# EAGLE design PC-FX (EAGLE 9.6.2)
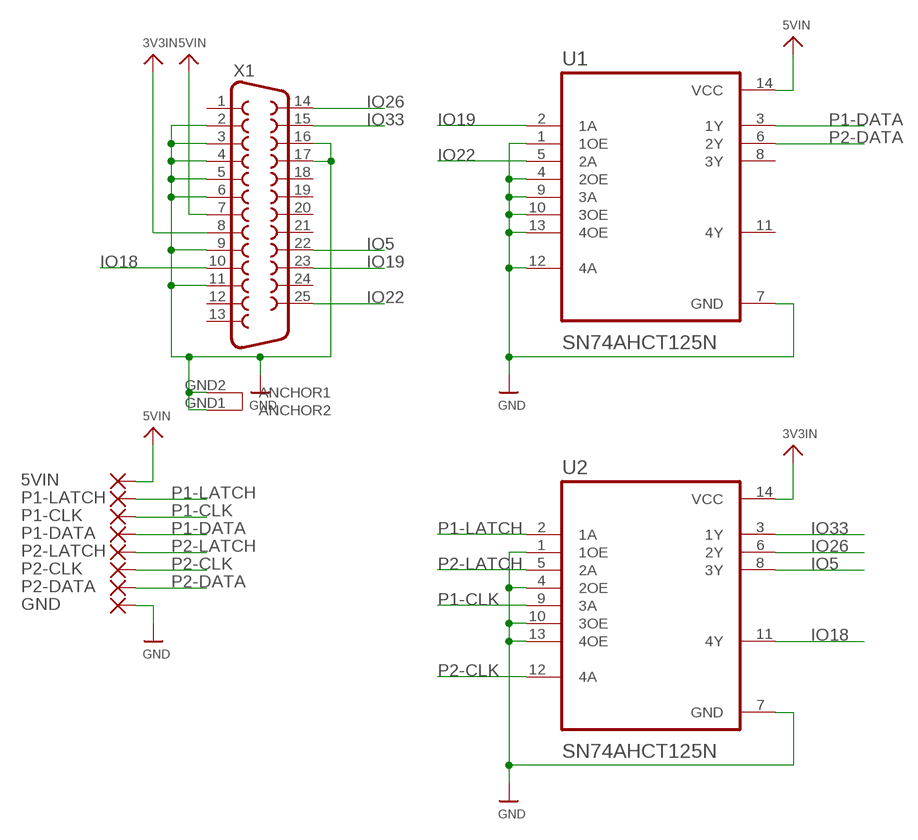
[diagram p0: schematic, sheet 1]

## Parts
5VIN  SMD5  [SMD2,54-5,08]
GND  SMD5  [SMD2,54-5,08]
P1-CLK  SMD5  [SMD2,54-5,08]
P1-DATA  SMD5  [SMD2,54-5,08]
P1-LATCH  SMD5  [SMD2,54-5,08]
P2-CLK  SMD5  [SMD2,54-5,08]
P2-DATA  SMD5  [SMD2,54-5,08]
P2-LATCH  SMD5  [SMD2,54-5,08]
U1  SN74AHCT125N  [DIP794W45P254L1969H508Q14]
U2  SN74AHCT125N  [DIP794W45P254L1969H508Q14]
X1  DB25_FEMALEHP  [F25HP]

## Nets
3V3IN: U2.14(VCC) X1.8
5VIN: 5VIN.1(P) U1.14(VCC) X1.7
GND: GND.1(P) U1.1(1OE) U1.4(2OE) U1.7(GND) U1.9(3A) U1.10(3OE) U1.12(4A) U1.13(4OE) U2.1(1OE) U2.4(2OE) U2.7(GND) U2.10(3OE) U2.13(4OE) X1.2 X1.3 X1.4 X1.5 X1.6 X1.9 X1.11 X1.16 X1.17 X1.GND1(ANCHOR2) X1.GND2(ANCHOR1)
IO5: U2.8(3Y) X1.22
IO18: U2.11(4Y) X1.10
IO19: U1.2(1A) X1.23
IO22: U1.5(2A) X1.25
IO26: U2.6(2Y) X1.14
IO33: U2.3(1Y) X1.15
P1-CLK: P1-CLK.1(P) U2.9(3A)
P1-DATA: P1-DATA.1(P) U1.3(1Y)
P1-LATCH: P1-LATCH.1(P) U2.2(1A)
P2-CLK: P2-CLK.1(P) U2.12(4A)
P2-DATA: P2-DATA.1(P) U1.6(2Y)
P2-LATCH: P2-LATCH.1(P) U2.5(2A)
Unconnected: U1.8(3Y) U1.11(4Y) X1.1 X1.12 X1.13 X1.18 X1.19 X1.20 X1.21 X1.24

## Library data of the parts
5VIN GND P1-CLK P1-DATA P1-LATCH P2-CLK P2-DATA P2-LATCH = wirepad:SMD5: SMD PAD
U1 U2 = SN74AHCT125N:SN74AHCT125N: None Check prices <https://pricing.snapeda.com/parts/SN74AHCT125N/Texas%20Instruments/view-part?ref=eda>; AVAILABILITY: In Stock; DESCRIPTION: Quadruple Bus Buffer Gates With 3-State Outputs 14-PDIP -40 to 125; MF: Texas Instruments; MP: SN74AHCT125N; PACKAGE: PDIP-14 Texas Instruments; PRICE: None; PURCHASE-URL: https://pricing.snapeda.com/search/part/SN74AHCT125N/?ref=eda
X1 = SparkFun-Retired:DB25_FEMALE: 25 Pin male connector. PCB edge mount for regular PCB thicknesses. This connector will connect directly to the back of a PC parallel port or through a normal DB25 extension cable (M/F). SKU: PRT-08287

## Board
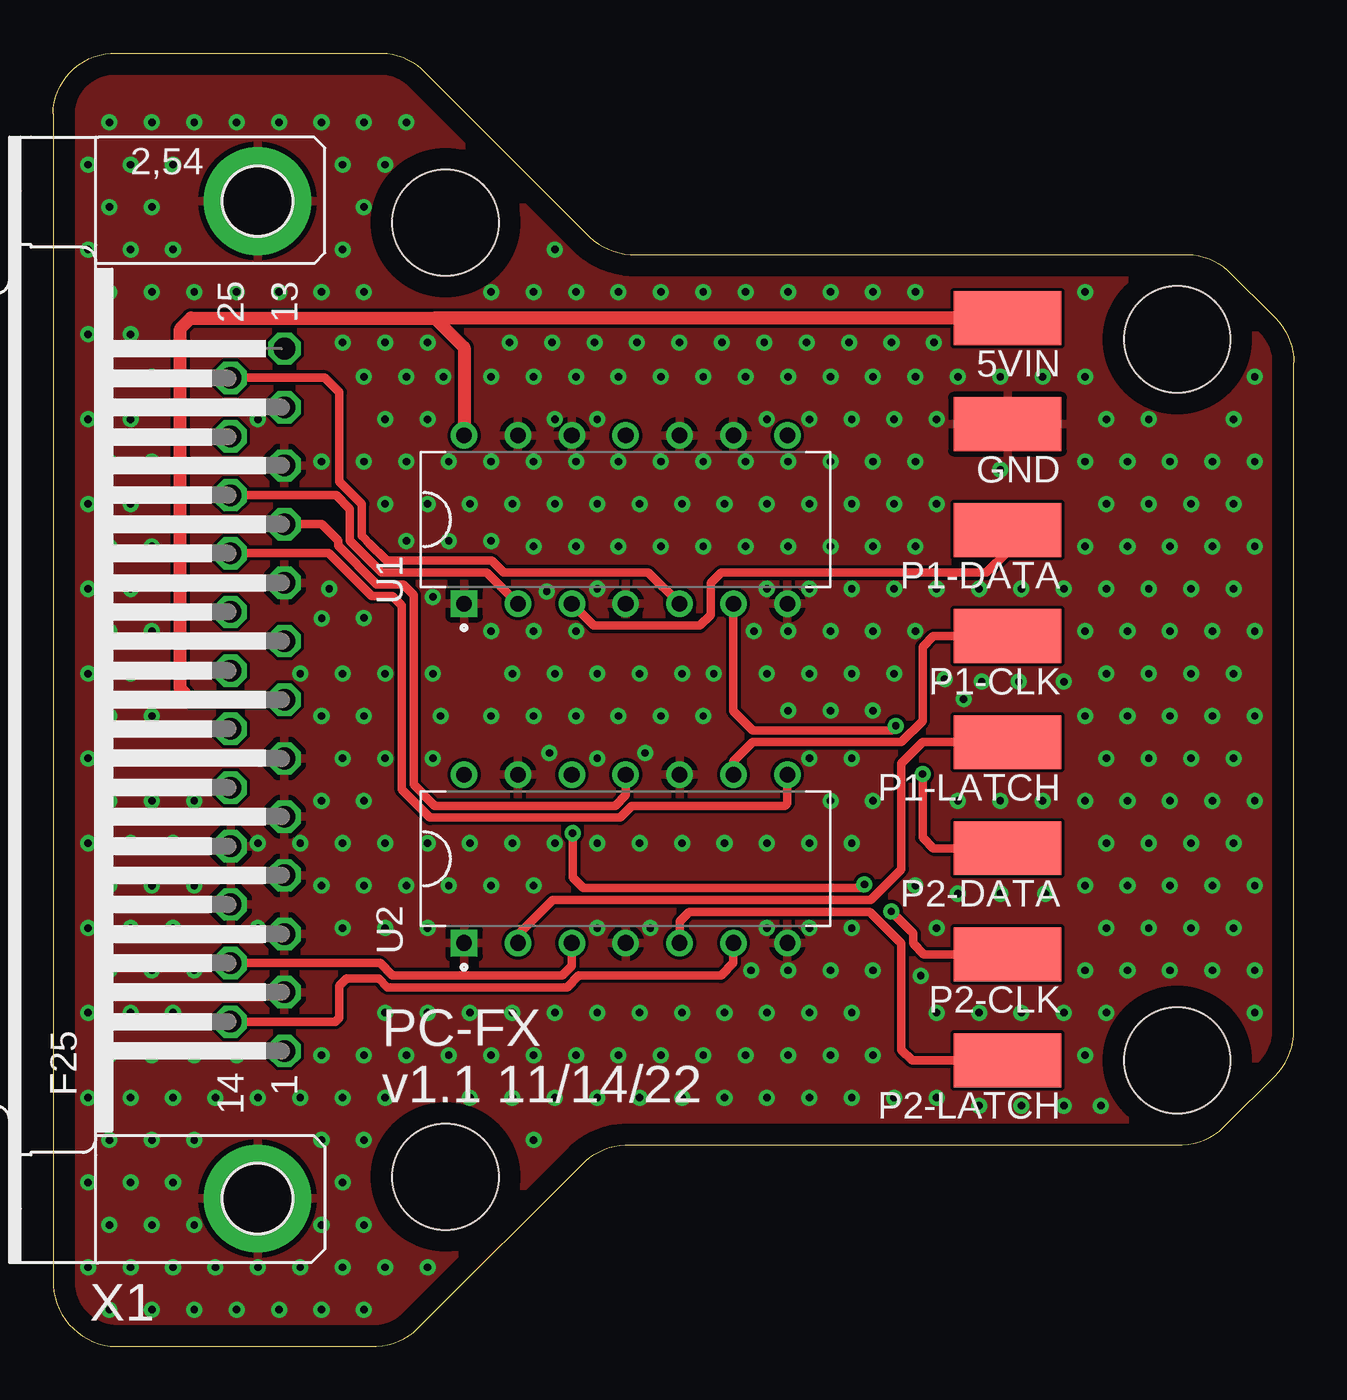
[diagram p1: board, top side]
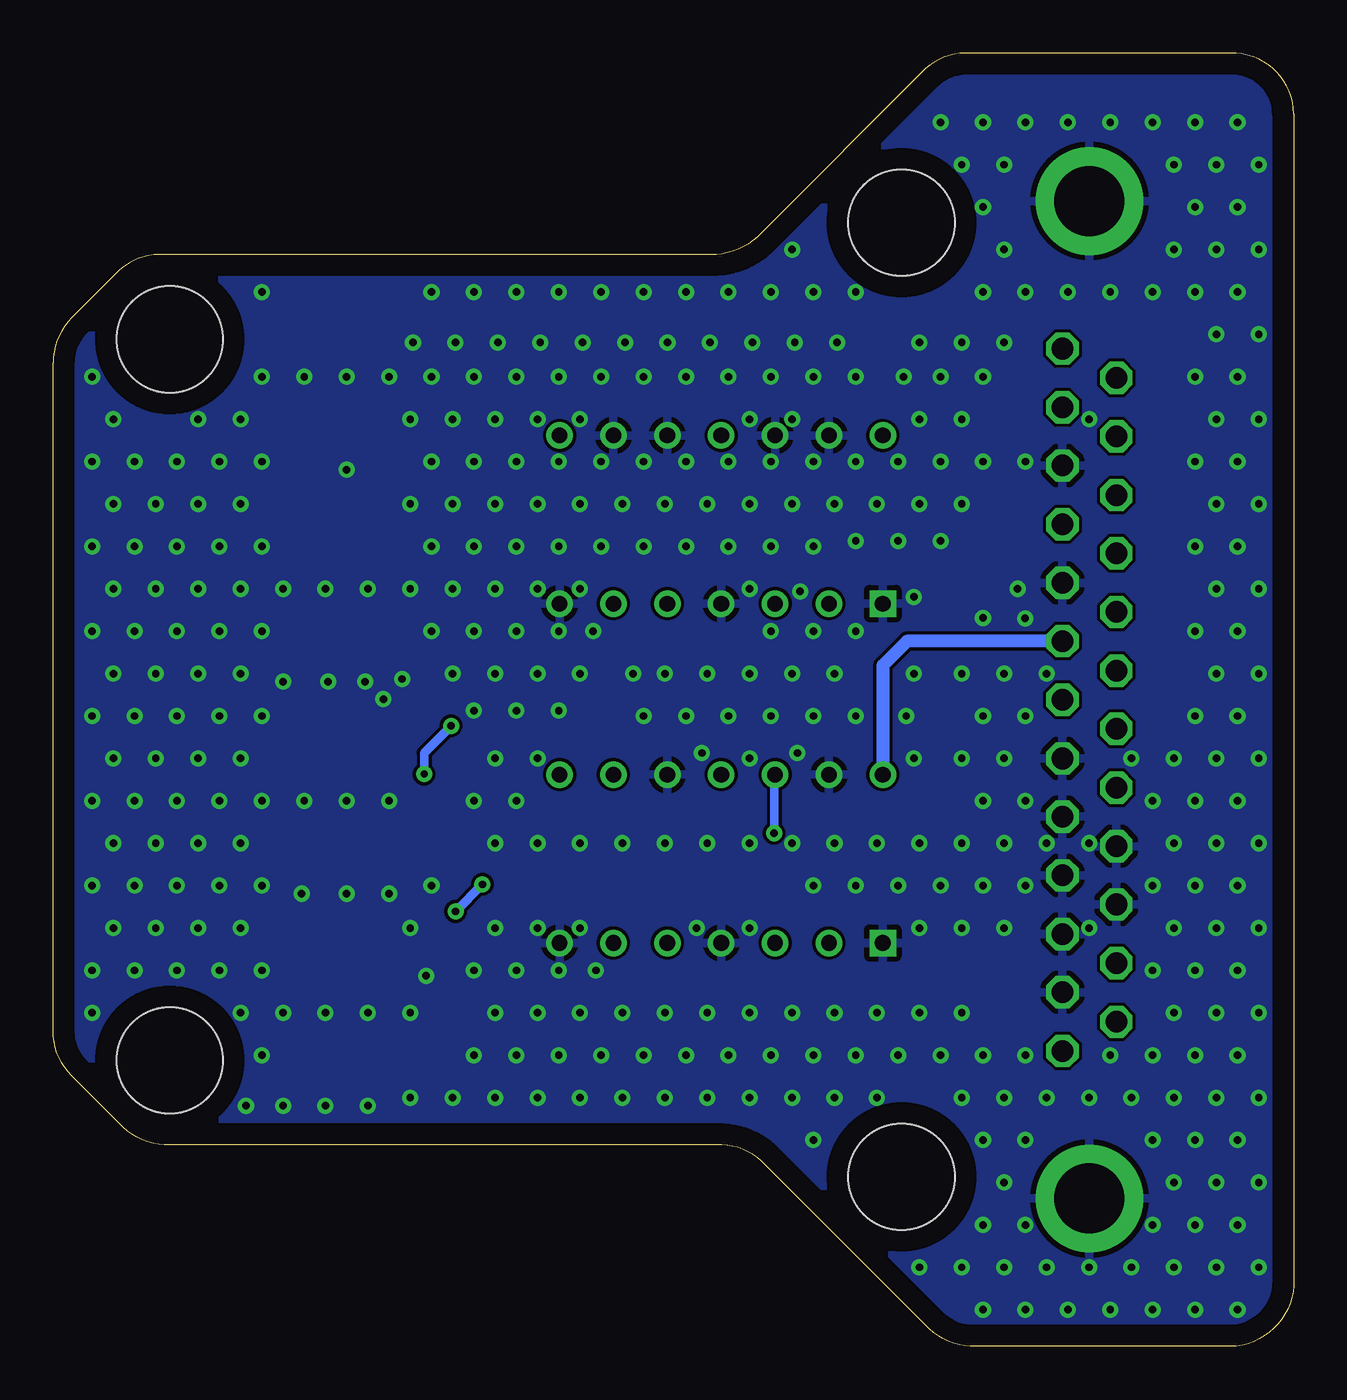
[diagram p2: board, bottom side, seen from below]

Size 58.5 x 61 mm. Coordinates in mm from the lower left corner, seen from the top.
Outline: 0,58.14 0,3.14 arc90 2.99,0 15.25,0 arc45 17.37,1.02 25.11,8.76 arc-45 27.23,9.5 53.25,9.5 arc45 55.37,10.52 57.61,12.76 arc45 58.5,14.88 58.5,46.4 arc45 57.61,48.52 55.37,50.76 arc45 53.25,51.5 27.23,51.5 arc-45 25.11,52.52 17.37,60.26 arc45 15.25,61 2.99,61 arc90 0,58.14
Copper layers (1*16): Top 0.035mm / dielectric 1.5mm / Bottom 0.035mm
Design rules "default": minimum track width 6mil, minimum drill 0.35mm, track to track 6mil, track to pad 6mil, pad to pad 6mil, via to via 6mil, smd to smd 6mil, copper to edge 40mil, drill to drill 6mil, minimum pad ring 10mil, minimum via ring 8mil, stop-mask expansion 4mil, vias tented up to drill 0.5mm, thermal gap 10mil
Holes 5 mm at 53,13.5 53,47.5 18.5,53 18.5,8

### Footprints (pad centres in the part's own frame; a part is rotated, then mirrored left to right if it is on the bottom)
SMD2,54-5,08 = smd 2.54 x 5.08: 1 0,0
DIP794W45P254L1969H508Q14 = drill 0.74 pad 1.14 square: 1 -3.97,7.62 | drill 0.74 pad 1.14: 2 -3.97,5.08; 3 -3.97,2.54; 4 -3.97,0; 5 -3.97,-2.54; 6 -3.97,-5.08; 7 -3.97,-7.62; 8 3.97,-7.62; 9 3.97,-5.08; 10 3.97,-2.54; 11 3.97,0; 12 3.97,2.54; 13 3.97,5.08; 14 3.97,7.62
F25HP = drill 1.016 octagon: 1 -16.561,-1.27; 2 -13.792,-1.27; 3 -11.049,-1.27; 4 -8.28,-1.27; 5 -5.512,-1.27; 6 -2.769,-1.27; 7 0,-1.27; 8 2.769,-1.27; 9 5.512,-1.27; 10 8.28,-1.27; 11 11.049,-1.27; 12 13.792,-1.27; 13 16.561,-1.27; 14 -15.189,1.27; 15 -12.421,1.27; 16 -9.652,1.27; 17 -6.909,1.27; 18 -4.14,1.27; 19 -1.372,1.27; 20 1.372,1.27; 21 4.14,1.27; 22 6.909,1.27; 23 9.652,1.27; 24 12.421,1.27; 25 15.189,1.27 | drill 3.302 pad 5.08: GND1 -23.52,0; GND2 23.52,0

### Placement (x,y rotation side)
5VIN  45,48.5 90 top
GND  45,43.5 90 top
P1-CLK  45,33.5 90 top
P1-DATA  45,38.5 90 top
P1-LATCH  45,28.5 90 top
P2-CLK  45,18.5 90 top
P2-DATA  45,23.5 90 top
P2-LATCH  45,13.5 90 top
U1  27,39 90 top
U2  27,23 90 top
X1  9.64,30.5 90 top

### Tracks (layer width: path | path; a pad name or v marks a point on that pad's centre or on a via)
3V3IN
  Bottom 0.61: X1.8 18.23,33.27 19.38,32.12 U2.14
5VIN
  Top 0.61: 18,48.5 6.5,48.5 6,48 6,31 6.5,30.5 X1.7 | U1.14 19.38,47.12 18,48.5 | 5VIN.1 18,48.5
GND  (via drill 0.35)
  other vias: 2.66,1.74 1.66,3.74 2.66,5.74 1.66,7.74 2.66,9.74 1.66,11.74 2.66,13.74 1.66,15.74 2.66,17.74 1.66,19.74 2.66,21.74 1.66,23.74 2.66,25.74 1.66,27.74 2.66,29.74 1.66,31.74 2.66,33.74 1.66,35.74 2.66,37.74 1.66,39.74 2.66,41.74 1.66,43.74 2.66,45.74 1.66,47.74 2.66,49.74 1.66,51.74 2.66,53.74 1.66,55.74 2.66,57.74 4.66,1.74 3.66,3.74 4.66,5.74 3.66,7.74 4.66,9.74 3.66,11.74 4.66,13.74 3.66,15.74 4.66,17.74 3.66,19.74 4.66,21.74 3.66,23.74 4.66,25.74 3.66,27.74 4.66,29.74 3.66,31.74 4.66,33.74 3.66,35.74 4.66,37.74 3.66,39.74 4.66,41.74 3.66,43.74 4.66,45.74 3.66,47.74 4.66,49.74 3.66,51.74 4.66,53.74 3.66,55.74 4.66,57.74 6.66,1.74 5.66,3.74 6.66,5.74 5.66,7.74 6.66,9.74 5.66,11.74 6.66,13.74 5.66,15.74 6.66,17.74 5.66,19.74 6.66,21.74 5.66,23.74 6.66,25.74 5.66,27.74 6.66,49.74 5.66,51.74 5.66,55.74 6.66,57.74 8.66,1.74 7.66,3.74 7.66,11.74 8.66,13.74 7.66,27.74 8.66,49.74 8.66,57.74 10.66,1.74 9.66,3.74 9.66,11.74 9.66,19.74 9.66,23.74 9.66,43.74 10.66,49.74 10.66,57.74 12.66,1.74 11.66,3.74 12.66,5.74 12.66,9.74 11.66,11.74 12.66,13.74 12.66,21.74 11.66,23.74 12.66,25.74 12.66,29.74 11.66,31.74 12.66,41.74 12.66,49.74 12.66,57.74 14.66,1.74 13.66,3.74 14.66,5.74 13.66,7.74 14.66,9.74 13.66,11.74 14.66,13.74 13.66,19.74 14.66,21.74 13.66,23.74 14.66,25.74 13.66,27.74 14.66,29.74 13.66,31.74 13.02,35.74 14.66,41.74 14.66,45.74 13.66,47.35 14.66,49.74 13.66,51.74 14.66,53.74 13.66,55.74 14.66,57.74 15.66,3.74 15.66,11.74 16.66,13.74 15.66,15.74 15.66,19.74 16.66,21.74 15.66,23.74 15.66,27.74 15.66,31.74 16.66,37.99 15.66,39.74 16.66,41.74 15.66,43.74 16.66,45.74 15.66,47.35 15.66,55.74 16.66,57.74 17.66,3.74 18.66,13.74 17.66,15.74 17.66,19.74 18.66,21.74 17.66,23.74 17.91,27.74 18.28,29.74 17.91,31.74 14.66,34.36 17.91,35.35 18.66,37.99 17.66,39.74 18.66,41.74 17.66,43.74 18.4,45.74 17.66,47.35 19.66,11.74 20.66,13.74 19.66,15.74 20.66,21.74 19.66,23.74 20.66,29.74 20.66,33.74 20.66,37.99 19.66,39.74 20.66,41.74 20.66,45.74 20.66,49.74 22.66,9.74 21.66,11.74 22.66,13.74 21.66,15.74 22.66,21.74 21.66,23.74 22.66,29.74 21.66,31.74 22.66,33.74 22.66,37.74 21.66,39.74 22.66,41.74 22.66,45.74 21.53,47.35 22.66,49.74 23.66,11.74 24.66,13.74 23.66,15.74 23.66,23.74 23.4,27.99 24.66,29.74 23.66,31.74 24.66,33.74 23.28,35.61 24.66,37.74 23.66,39.74 24.66,41.74 23.66,43.74 24.66,45.74 23.53,47.35 24.66,49.74 23.66,51.74 25.66,11.74 26.66,13.74 25.66,15.74 25.66,19.74 25.66,23.74 25.66,27.74 26.66,29.74 25.66,31.74 25.66,35.74 26.66,37.74 25.66,39.74 26.66,41.74 25.66,43.74 26.66,45.74 25.53,47.35 26.66,49.74 27.66,11.74 28.66,13.74 27.66,15.74 28.16,19.74 27.66,23.74 27.91,27.99 28.66,29.74 27.66,31.74 12.67,34.34 28.66,37.74 27.66,39.74 28.66,41.74 28.66,45.74 27.53,47.35 28.66,49.74 29.66,11.74 30.66,13.74 29.66,15.74 29.66,23.74 30.66,29.74 29.66,31.74 30.66,37.74 29.66,39.74 30.66,41.74 30.66,45.74 29.53,47.35 30.66,49.74 31.66,11.74 32.66,13.74 31.66,15.74 32.91,17.74 31.66,23.74 31.15,31.74 33.04,33.74 32.66,37.74 31.66,39.74 32.66,41.74 32.66,45.74 31.53,47.35 32.66,49.74 33.66,11.74 34.66,13.74 33.66,15.74 34.66,17.74 33.66,19.74 33.66,23.74 34.66,29.99 33.66,31.74 34.66,33.74 33.66,35.74 34.66,37.74 33.66,39.74 34.66,41.74 33.66,43.74 34.66,45.74 33.53,47.35 34.66,49.74 35.66,11.74 36.66,13.74 35.66,15.74 36.66,17.74 35.66,19.74 35.66,23.74 36.66,25.74 35.66,27.74 36.66,29.99 35.66,31.74 36.66,33.74 35.66,35.74 36.66,37.74 35.66,39.74 36.66,41.74 35.66,43.74 36.66,45.74 35.53,47.35 36.66,49.74 37.66,11.74 38.66,13.74 37.66,15.74 38.66,17.74 37.66,19.74 37.66,23.74 38.66,25.74 37.66,27.74 38.66,29.99 37.66,31.74 38.66,33.74 37.66,35.74 38.66,37.74 37.66,39.74 38.66,41.74 37.66,43.74 38.66,45.74 37.53,47.35 38.66,49.74 39.66,11.74 40.91,17.48 40.66,21.74 39.66,31.74 40.66,33.74 39.66,35.74 40.66,37.74 39.66,39.74 40.66,41.74 39.66,43.74 40.66,45.74 39.53,47.35 40.66,49.74 41.66,11.74 41.66,15.74 41.66,19.74 42.66,21.35 42.66,25.74 42.93,30.53 42.04,31.48 41.66,35.74 41.66,39.74 41.66,43.74 42.66,45.74 41.53,47.35 43.66,11.35 43.66,15.74 44.66,21.35 44.66,25.74 43.78,31.35 43.66,35.74 44.66,41.35 44.66,45.74 45.66,11.35 45.66,15.74 46.78,21.35 46.66,25.74 45.53,31.35 45.66,35.74 46.66,45.74 47.66,11.35 48.66,13.74 47.66,15.74 48.66,17.74 48.66,21.74 48.66,25.74 48.66,29.74 47.66,31.35 48.66,33.74 47.66,35.74 48.66,37.74 48.66,41.74 48.66,45.74 48.66,49.74 49.4,11.35 49.66,15.74 50.66,17.74 49.66,19.74 50.66,21.74 49.66,23.74 50.66,25.74 49.66,27.74 50.66,29.74 49.66,31.74 50.66,33.74 49.66,35.74 50.66,37.74 49.66,39.74 50.66,41.74 49.66,43.74 52.66,17.74 51.66,19.74 52.66,21.74 51.66,23.74 52.66,25.74 51.66,27.74 52.66,29.74 51.66,31.74 52.66,33.74 51.66,35.74 52.66,37.74 51.66,39.74 52.66,41.74 51.66,43.74 54.66,17.74 53.66,19.74 54.66,21.74 53.66,23.74 54.66,25.74 53.66,27.74 54.66,29.74 53.66,31.74 54.66,33.74 53.66,35.74 54.66,37.74 53.66,39.74 54.66,41.74 56.66,15.74 56.66,17.74 55.66,19.74 56.66,21.74 55.66,23.74 56.66,25.74 55.66,27.74 56.66,29.74 55.66,31.74 56.66,33.74 55.66,35.74 56.66,37.74 55.66,39.74 56.66,41.74 55.66,43.74 56.66,45.74
  pour Top: 0,0 0,61 28.49,61 28.49,51.64 58.99,51.64 58.99,9.5 27.99,9.5 27.99,0
  pour Bottom: 0,0 0,61 28.49,61 28.49,51.64 58.99,51.64 58.99,9.5 27.99,9.5 27.99,0
IO5
  Top 0.406: U2.8 34.62,25.62 34.5,25.5 27.29,25.5 26.73,24.94 17.77,24.94 16.44,26.27 16.44,34.94 16,35.38 15.04,35.38 13.01,37.41 X1.22
IO18
  Top 0.406: U2.11 27,26 26.5,25.5 18,25.5 17,26.5 17,35.44 16.5,35.94 15.27,35.94 13.44,37.77 13.44,38 12.66,38.78 X1.10
IO19
  Top 0.406: U1.2 20.45,36.5 15.5,36.5 14,38 14,39.5 13.35,40.15 X1.23
IO22
  Top 0.406: U1.5 28.07,36.5 21.24,36.5 20.68,37.06 15.73,37.06 14.89,37.9 14.64,38.15 14.56,38.23 14.56,39.73 13.5,40.79 13.5,45 12.81,45.69 X1.25
IO26
  Top 0.406: U2.6 32.08,18.08 31.5,17.5 24.79,17.5 24.23,16.94 15.77,16.94 15.36,17.36 13.86,17.36 13.5,17 13.5,15.5 13.31,15.31 X1.14
IO33
  Top 0.406: U2.3 24.46,17.96 24,17.5 16,17.5 15.42,18.08 X1.15
P1-CLK
  Top 0.406: U2.9 32.08,27.58 33,28.5 40,28.5 41,29.5 41,33 41.5,33.5 P1-CLK.1
P1-DATA
  Top 0.406: U1.3 25.49,34 30.5,34 31,34.5 31,36 31.5,36.5 44,36.5 45,37.5 P1-DATA.1
P1-LATCH
  Top 0.406: U2.2 21.92,19.42 23.56,21.06 38.56,21.06 40,22.5 40,27.5 41,28.5 P1-LATCH.1
P2-CLK  (via drill 0.35)
  Top 0.406: v24.5,24.21 24.5,22.12 25,21.62 38.08,21.62 v38.26,21.79 | v39.52,20.52 40.56,19.48 40.56,19 41.06,18.5 P2-CLK.1
  Bottom 0.406: U2.12 24.5,26.93 v24.5,24.21 | v38.26,21.79 v39.52,20.53 v39.52,20.52
P2-DATA  (via drill 0.35)
  Top 0.406: U1.6 32.08,29.98 33,29.06 39.52,29.06 v39.73,29.27 | v41,27 41,24 41.5,23.5 P2-DATA.1
  Bottom 0.406: v39.73,29.27 41,28 v41,27
P2-LATCH
  Top 0.406: U2.5 29.54,20.04 30,20.5 38.5,20.5 40,19 40,14 40.5,13.5 P2-LATCH.1

### Text on the board
tPlace: PC-FX / v1.1 11/14/22